# Altium project ESP32Robot.PrjPcb
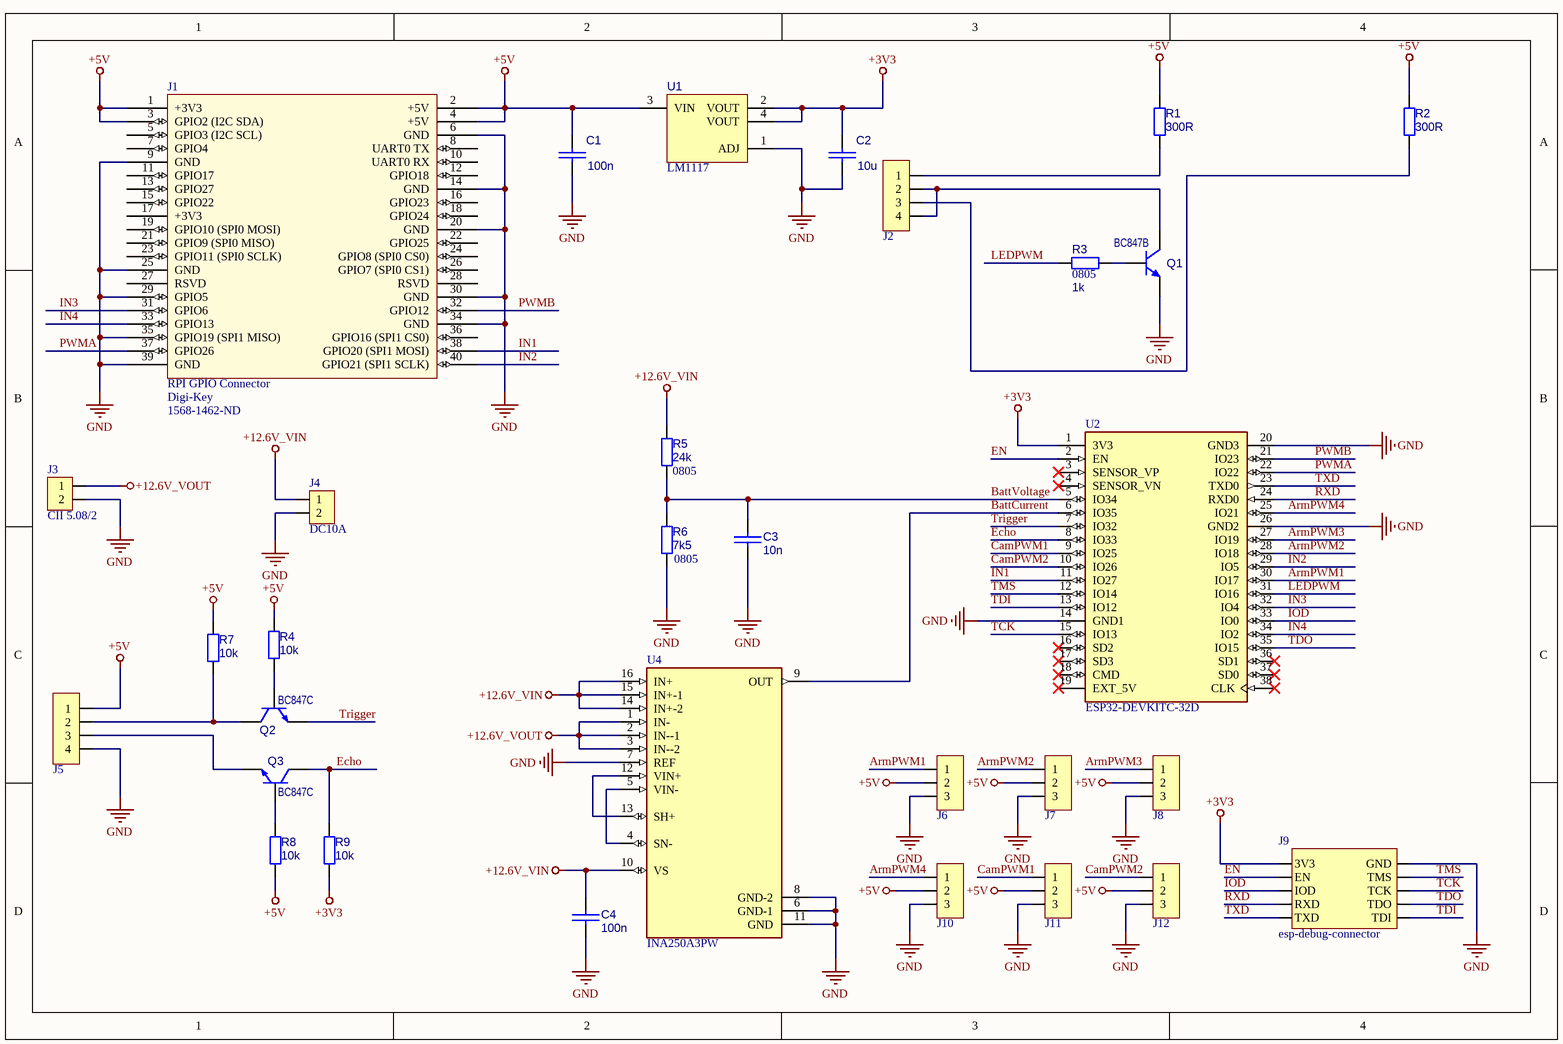
[diagram p0: ESP32RobotBoard.SchDoc]
1 sheet, 31 parts. Net scope: global (net labels, ports and power ports of the same name join across sheets).
Board file: ESP32RobotBoard.PcbDoc

## Sheet ESP32RobotBoard.SchDoc
size A4

### Parts
C1  100n  [C0805]
C2  10u  [C0805]
C3  10n  [C0805]
C4  100n  [C0805]
J1  RPI GPIO Connector  Supplier 1: Digi-Key  Supplier Part Number 1: 1568-1462-ND  [rpi]
J2  BUCHSEHN_1X4  [MKDSN2,5/4-5,08]  (value not drawn)
J3  value CII 5.08/2  [MKDSN2,5/2-5,08]  (hidden comment: 2X1Molex)
J4  value DC10A  [DC10A]  (hidden comment: CONN_DC10A)
J5  BUCHSEHN_1X4  [MKDSN2,5/4-5,08]  (value not drawn)
J6  BUCHSEHN_1X3  [HEADER_3X1 - male]  (value not drawn)
J7  BUCHSEHN_1X3  [HEADER_3X1 - male]  (value not drawn)
J8  BUCHSEHN_1X3  [HEADER_3X1 - male]  (value not drawn)
J9  esp-debug-connector  [SAMTEC-FTS-105-01-X-DV]
J10  BUCHSEHN_1X3  [HEADER_3X1 - male]  (value not drawn)
J11  BUCHSEHN_1X3  [HEADER_3X1 - male]  (value not drawn)
J12  BUCHSEHN_1X3  [HEADER_3X1 - male]  (value not drawn)
Q1  PartNumber: BC847B  [SOT23-3]  (hidden comment: NPN)
Q2  value BC847C  [SOT23-3]  (hidden comment: BC847C_SOT23)
Q3  value BC847C  [SOT23-3]  (hidden comment: BC847C_SOT23)
R1  300R  [R0805]
R2  300R  [R0805]
R3  Package: 0805  [R0805]  (hidden comment: 1k)
R4  10k  [R0805]
R5  24k  Package: 0805  [R0805]
R6  Package: 0805  [R0805]  (hidden comment: 7k5)
R7  10k  [R0805]
R8  10k  [R0805]
R9  10k  [R0805]
U1  LM1117  [SOT223]
U2  ESP32-DEVKITC-32D  [Espressif_Systems_ESP32-WROOM-32D_MFG]
U4  INA250A3PW  [TSSOP-16]

### Nets
+3V3: C2.1 J9.1(3V3) R9.1 U1.2(VOUT) U1.4(VOUT) U2.1(3V3)
+5V: C1.1 J1.1(+3V3) J1.2(+5V) J1.3(GPIO2_(I2C_SDA)) J1.4(+5V) J5.1 J6.2 J7.2 J8.2 J10.2 J11.2 J12.2 R1.2 R2.2 R4.2 R7.2 R8.1 U1.3(VIN)
+12.6V_VIN: C4.1 J4.1 R5.2 U4.10(VS) U4.14(IN+-2) U4.15(IN+-1) U4.16(IN+)
+12.6V_VOUT: J3.1 U4.1(IN-) U4.2(IN--1) U4.3(IN--2)
GND: C1.2 C2.2 C3.2 C4.2 J1.6(GND) J1.9(GND) J1.14(GND) J1.20(GND) J1.25(GND) J1.29(GPIO5) J1.30(GND) J1.34(GND) J1.35(GPIO19_(SPI1_MISO)) J1.39(GND) J3.2 J4.2 J5.4 J6.3 J7.3 J8.3 J9.2(GND) J10.3 J11.3 J12.3 Q1.2(E) R6.1 U1.1(ADJ) U2.14(GND1) U2.20(GND3) U2.26(GND2) U4.6(GND-1) U4.7(REF) U4.8(GND-2) U4.11(GND)
ArmPWM1: J6.1 U2.30(IO17)
ArmPWM2: J7.1 U2.28(IO18)
ArmPWM3: J8.1 U2.27(IO19)
ArmPWM4: J10.1 U2.25(IO21)
BattCurrent: U2.6(IO35) U4.9(OUT)
BattVoltage: C3.1 R5.1 R6.2 U2.5(IO34)
CamPWM1: J11.1 U2.9(IO25)
CamPWM2: J12.1 U2.10(IO26)
Echo: Q3.3(C) R9.2 U2.8(IO33)
EN: J9.3(EN) U2.2(EN)
IN1: J1.38(GPIO20_(SPI1_MOSI)) U2.11(IO27)
IN2: J1.40(GPIO21_(SPI1_SCLK)) U2.29(IO5)
IN3: J1.31(GPIO6) U2.32(IO4)
IN4: J1.33(GPIO13) U2.34(IO2)
IOD: J9.5(IOD) U2.33(IO0)
LEDPWM: R3.1 U2.31(IO16)
PWMA: J1.37(GPIO26) U2.22(IO22)
PWMB: J1.32(GPIO12) U2.21(IO23)
RXD: J9.7(RXD) U2.24(RXD0)
TCK: J9.6(TCK) U2.15(IO13)
TDI: J9.10(TDI) U2.13(IO12)
TDO: J9.8(TDO) U2.35(IO15)
TMS: J9.4(TMS) U2.12(IO14)
Trigger: Q2.2(E) U2.7(IO32)
TXD: J9.9(TXD) U2.23(TXD0)
NetJ2_1: J2.1 R1.1
NetJ2_2: J2.2 J2.4 Q1.3(C)
NetJ2_3: J2.3 R2.1
NetJ5_2: J5.2 Q2.3(C) R7.1
NetJ5_3: J5.3 Q3.2(E)
NetQ1_1: Q1.1(B) R3.2
NetQ2_1: Q2.1(B) R4.1
NetQ3_1: Q3.1(B) R8.2
NetU4_4: U4.4(SN-) U4.5(VIN-)
NetU4_12: U4.12(VIN+) U4.13(SH+)

Not connected (* = marked no-connect by the designer): J1 5(GPIO3_(I2C_SCL)) 7(GPIO4) 8(UART0_TX) 10(UART0_RX) 11(GPIO17) 12(GPIO18) 13(GPIO27) 15(GPIO22) 16(GPIO23) 17(+3V3) 18(GPIO24) 19(GPIO10_(SPI0_MOSI)) 21(GPIO9_(SPI0_MISO)) 22(GPIO25) 23(GPIO11_(SPI0_SCLK)) 24(GPIO8_(SPI0_CS0)) 26(GPIO7_(SPI0_CS1)) 27(RSVD) 28(RSVD) 36(GPIO16_(SPI1_CS0)); U2 3(SENSOR_VP)* 4(SENSOR_VN)* 16(SD2)* 17(SD3)* 18(CMD)* 19(EXT_5V)* 36(SD1)* 37(SD0)* 38(CLK)*

### Library data of the parts
C1 C4 = Cap100n_50V_0805: Ceramic Chip Capacitor 0805 size; Manufacturer: NIC COMPONENTS; Voltage: 50V; Package: 0805; OrderCode: 93-02-37; Price: 4; Distributor: RET; Value: 100n
C2 = Cap10u_10V_0805: Ceramic Chip Capacitor 0805 size; Manufacturer: NIC; Voltage: 10V; Package: 0805; OrderCode: 93-04-42; Price: 9; Distributor: RET; Value: 10u
C3 = Cap10n_50V_0805: Ceramic Chip Capacitor 0805 size; Manufacturer: NIC COMPONENTS; Voltage: 50V; Package: 0805; OrderCode: 93-02-32; Price: 4; Distributor: RET; Value: 10n
J1 = rpi connector: GPIO Header for Raspberry Pi A+/B+/Pi 2/Pi 3 - 2x20; Manufacturer: SparkFun Electronics; Manufacturer Part Number: PRT-14017; Nils Minor: author; nilsminor@web.de: mail; RoHS: RoHS Compliant; Category: Development Boards, Kits, Programmers; Stock 1: 150; Pricing 1: 1=1.84 (EUR); Part Status: Active; Accessory Type: Connector; For Use With/Related Products: Raspberry Pi; ComponentLink1URL: https://cdn.sparkfun.com/datasheets/Dev/RaspberryPi/12313.pdf; ComponentLink1Description: https://cdn.sparkfun.com/datasheets/Dev/RaspberryPi/12313.pdf
J2 J5 = BUCHSEHN_1X4: 1X4_HEADER; Manufacturer: E-TEC; Value: 1X4 female; OrderCode: 53-19-93; Distributor: RET; Price: 82
J3 = 2X1Molex: Manufacturer: STELVIO; OrderCode: 53-08-03; Distributor: RET; Price: 64
J4 = CONN_DC10A: DC 10A connector; Manufacturer: CLIFF; OrderCode: 53-10-45; Distributor: RET; Price: 200
J6-J8 J10-J12 = BUCHSEHN_1X3: 1X3_HEADER; Manufacturer: E-TEC; Value: 1X3 male; OrderCode: 53-00-05; Distributor: RET; Price: 82
Q1 = NPN: NPN small-signal 100mA 45V 250mW SOT-23; Manufacturer: ON Semi; Serpa: 032-00169
Q2 Q3 = BC847C_SOT23: NPN Bipolar transistor 100mA 45V UCE; Manufacturer: NXP; Distributor: RET; OrderCode: 44-01-75; Package: SOT23
R1 R2 = Res300R_125mW_0805: Chip Resistor Thick Film; Manufacturer: YAGEO; Power: 125mW; Package: 0805; Distributor: RET; OrderCode: 96-01-94; Price: 1,8; Value: 300R
R3 = Res1k_125mW_0805: Chip Resistor Thick Film; Manufacturer: YAGEO; Power: 125mW; Distributor: RET; OrderCode: 96-02-06; Price: 2; Value: 1k
R4 R7-R9 = Res10k_125mW_0805: Chip Resistor Thick Film; Manufacturer: YAGEO; Power: 125mW; Package: 0805; Distributor: RET; OrderCode: 96-02-32; Price: 1,8; Value: 10k
R5 = Res24k_125mW_0805: Chip Resistor Thick Film; Manufacturer: YAGEO; Power: 125mW; Distributor: RET; OrderCode: 96-02-34; Price: 2; Value: 24k
R6 = Res7k5_125mW_0805: Chip Resistor Thick Film; Manufacturer: YAGEO; Power: 125mW; Distributor: RET; OrderCode: 96-02-56; Price: 1,8; Value: 7k5
U1 = LM1117-ADJ: 15V 800mA adjustable LDO SOT-223; Manufacturer: National Semiconductor; Value: LM1117-ADJ; Distributor: RET; OrderCode: 76-00-51; Price: 320; Package: SOT223
U2 = ESP32-DEVKITC-32D: EVAL BOARD FOR ESP-WROOM-32; MF: Espressif Systems; Value: *; MP: ESP32-DEVKITC-32D; Price: None; Check_prices: https://www.snapeda.com/parts/ESP32-DEVKITC-32D/Espressif%20Systems/view-part/2777395/?ref=eda; SnapEDA_Link: https://www.snapeda.com/parts/ESP32-DEVKITC-32D/Espressif%20Systems/view-part/2777395/?ref=snap; Availability: Warning; Purchase-URL: https://pricing.snapeda.com/search/part/ESP32-DEVKITC-32D/?ref=eda; Package: None
U4 = INA250A3PW: 36V, bi-directional, precision current sense amplifier w/int. shunt resistor 16-TSSOP -40 to 125; MF: Texas Instruments; Value: *; Availability: Warning; Price: None; Mouser-Purchase-URL: https://snapeda.com/shop?store=Mouser&id=835597; SnapEDA_Link: https://www.snapeda.com/parts/INA250A3PW/Texas%20Instruments/view-part/835597/?ref=snap; Texas_Instruments-Purchase-URL: https://snapeda.com/shop?store=Texas+Instruments&id=835597; Package: TSSOP-16 Texas Instruments; MP: INA250A3PW
J9 = esp-debug-connector: Price: 1000; Part number: 53-04-57